# Altium project JacdacServoDual 23.PrjPCB
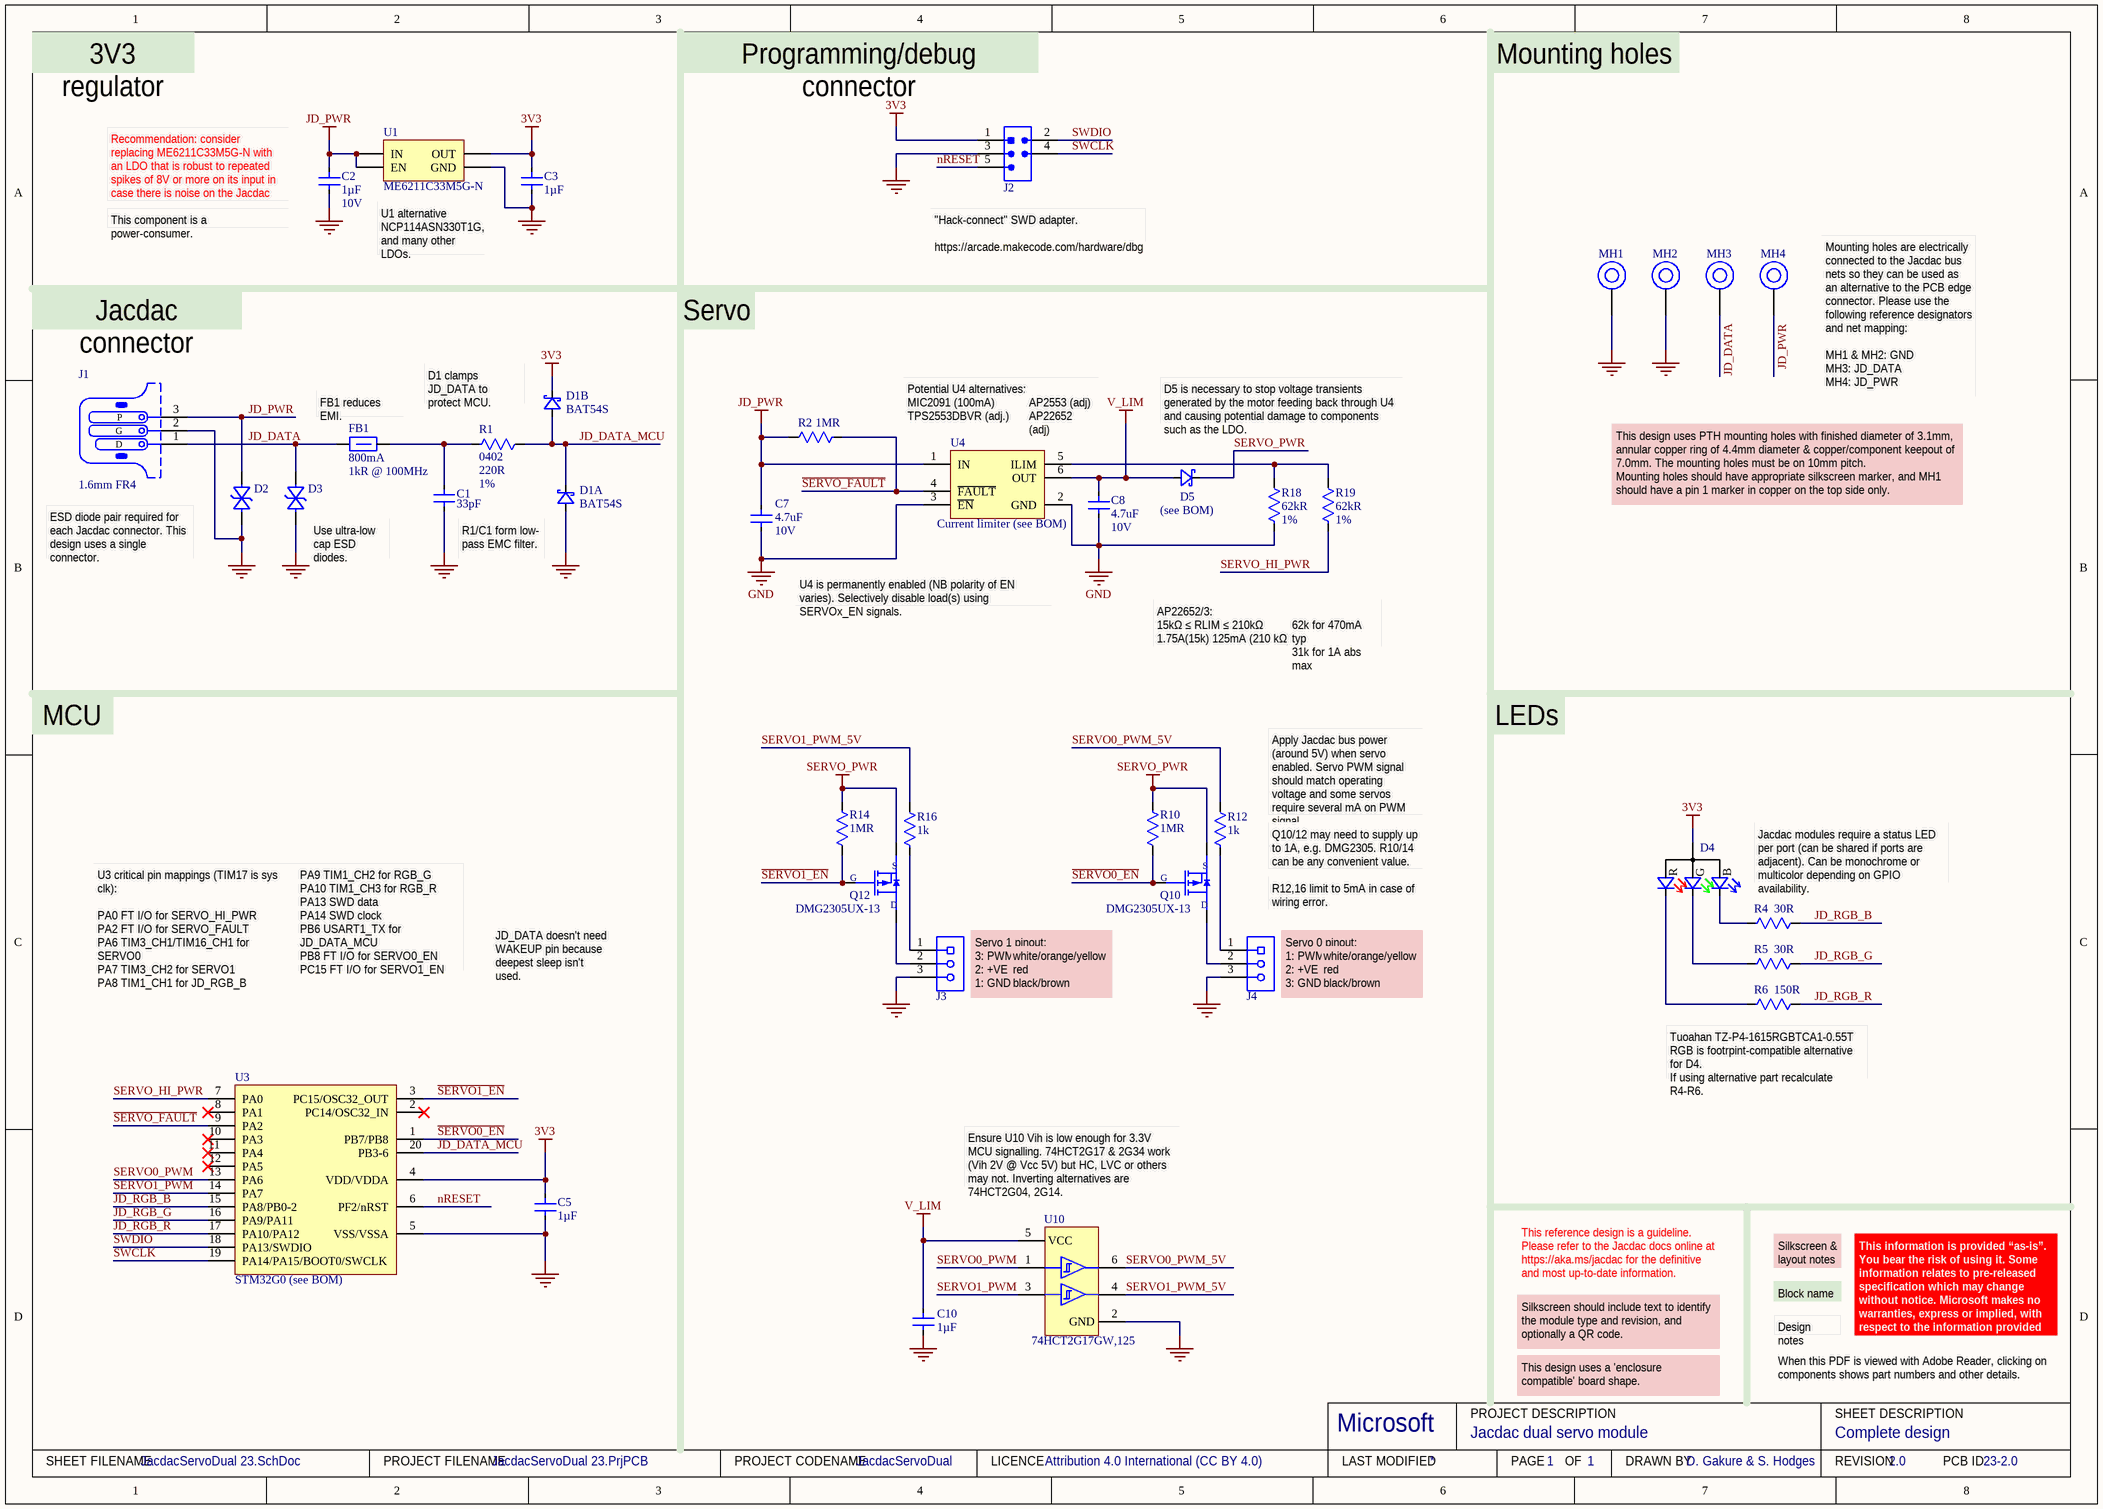
[diagram p0: JacdacServoDual 23.SchDoc]
ProjectCodeName: JacdacServoDual; ProjectCodenameDescription: Jacdac dual servo module; ProjectCodenameID: 23; ProjectDrawnBy: D. Gakure & S. Hodges; ProjectLicenceTerms: Attribution 4.0 International (CC BY 4.0); ProjectRevision: 2.0
1 sheet, 38 parts. Net scope: global (net labels, ports and power ports of the same name join across sheets).
Board file: JacdacServoDual 23.PcbDoc

## Sheet JacdacServoDual 23.SchDoc: Complete design
size A3; DrawnBy: D. Gakure & S. Hodges; DocumentNumber: 1; Revision: 2.0; SheetNumber: 1; SheetTotal: 1; VersionControl_RevNumber: 1

### Parts
C1  Capacitance: 33pF  [C0402_0.55MM - without outline]  (hidden comment: CL05C330JB5NNNC)
C2  Capacitance: 1µF  Voltage Rating: 10V  [C0402_0.55MM - without outline]  (hidden comment: CL05A105KP5NNNC)
C3  Capacitance: 1µF  [C0402_0.55MM - without outline]  (hidden comment: CL05A105KP5NNNC)
C5  Capacitance: 1µF  [C0402_0.55MM - without outline]  (hidden comment: CL05A105KP5NNNC)
C7  Capacitance: 4.7uF  Voltage Rating: 10V  [R0402 - Without outline]  (hidden comment: CL05A475MP5NRNC)
C8  Capacitance: 4.7uF  Voltage Rating: 10V  [R0402 - Without outline]  (hidden comment: CL05A475MP5NRNC)
C10  Capacitance: 1µF  [C0402_0.55MM - without outline]  (hidden comment: CL05A105KP5NNNC)
D1  BAT54S  [NXP-BAT54S-TO-236AB - without outline]  (parts A,B of 2)
D2  RCLAMP0521P-N  [TVS 0402 - L]  (value not drawn)
D3  RCLAMP0521P-N  [TVS 0402 - L]  (value not drawn)
D4  HSMF-C114  [HSMF-C114]  (value not drawn)
D5  Generic Part Number: (see BOM)  [MBR120VLSFT3G]  (hidden comment: MBR120VLSFT3G)
FB1  Current Rating: 800mA  Impedance: 1kR @ 100MHz  [TDK MPZ1608 0.8mm - without outline]  (hidden comment: TDK MPZ1608S102ATA00)
J1  PCB Type: 1.6mm FR4  [JACDAC_EDGE_CONNECTOR_NO_TRACES]  (hidden comment: 3 pin JACDAC edge connector)  (no BOM)
J2  Hack Connect Mini 1.27 mm pitch 2-row  [HACK_CONNECT_MINI_5_X_1_27]  (value not drawn)  (no BOM)
J3  TSM-103-01-L-SH-A  [TSM-103-01-L-SH-A]  (value not drawn)
J4  TSM-103-01-L-SH-A  [TSM-103-01-L-SH-A]  (value not drawn)
MH1  MH_7.0MMK_4.4MMC_3.1MMD_PTH  [MH_7.0MMK_4.4MMC_3.1MMD_PTH]  (value not drawn)  (no BOM)
MH2  MH_7.0MMK_4.4MMC_3.1MMD_PTH  [MH_7.0MMK_4.4MMC_3.1MMD_PTH]  (value not drawn)  (no BOM)
MH3  MH_7.0MMK_4.4MMC_3.1MMD_PTH  [MH_7.0MMK_4.4MMC_3.1MMD_PTH]  (value not drawn)  (no BOM)
MH4  MH_7.0MMK_4.4MMC_3.1MMD_PTH  [MH_7.0MMK_4.4MMC_3.1MMD_PTH]  (value not drawn)  (no BOM)
Q10  Manufacturer Part Number: DMG2305UX-13  [DIODES-SOT23-3]  (hidden comment: MOSFET P-CH 20V 4.2A SOT23)
Q12  Manufacturer Part Number: DMG2305UX-13  [DIODES-SOT23-3]  (hidden comment: MOSFET P-CH 20V 4.2A SOT23)
R1  Case Code (Imperial): 0402  Resistance: 220R  Tolerance: 1%  [RES0402]  (hidden comment: RC0402FR-07220RL)
R2  Resistance: 1MR  [R0402 - Without outline]  (hidden comment: RC0402FR-071ML)
R4  Resistance: 30R  [R0402 - Without outline]  (hidden comment: RC0402FR-0730RL)
R5  Resistance: 30R  [R0402 - Without outline]  (hidden comment: RC0402FR-0730RL)
R6  Resistance: 150R  [R0402 - Without outline]  (hidden comment: RC0402FR-07150RL)
R10  Resistance: 1MR  [R0402 - Without outline]  (hidden comment: RC0402FR-071ML)
R12  Resistance: 1k  [RES0402]  (hidden comment: RC0402FR-071KL)
R14  Resistance: 1MR  [R0402 - Without outline]  (hidden comment: RC0402FR-071ML)
R16  Resistance: 1k  [RES0402]  (hidden comment: RC0402FR-071KL)
R18  Resistance: 62kR  Tolerance: 1%  [R0402 - Without outline]  (hidden comment: RC0402FR-0762KL)
R19  Resistance: 62kR  Tolerance: 1%  [R0402 - Without outline]  (hidden comment: RC0402FR-0762KL)
U1  ME6211C33M5G-N  [MICRONE-SOT23-5]
U3  Generic Part Number: STM32G0 (see BOM)  [20-TSSOP]
U4  Generic Part Number: Current limiter (see BOM)  [SOT-26]  (hidden comment: AP22652W6-7)
U10  74HCT2G17GW,125  [6TSSOP_SOT457]

### Nets
3V3: C3.2 C5.2 D1.2(K) D4.1(A) J2.1(VCC) U1.5(OUT) U3.4(VDD/VDDA)
GND: C1.1 C2.1 C3.1 C5.1 C7.1 C8.1 C10.1 D1.1(A) D2.2(A) D3.2(A) J1.2(G) J2.3(GND) J3.3 J4.3 MH1.1 MH2.1 R18.1 U1.2(GND) U3.5(VSS/VSSA) U4.2(GND) U4.3(~{EN}) U10.2(GND)
JD_PWR: C2.2 C7.2 D2.1(K) J1.3(P) MH4.1 R2.1 U1.1(IN) U1.3(EN) U4.1(IN)
SERVO_PWR: D5.1(K) Q10.2(S) Q12.2(S) R10.2 R14.2
V_LIM: C8.2 C10.2 D5.2(A) U4.6(OUT) U10.5(VCC)
~{SERVO0_EN}: Q10.1(G) R10.1 U3.1(PB7/PB8)
~{SERVO1_EN}: Q12.1(G) R14.1 U3.3(PC15/OSC32_OUT)
~{SERVO_FAULT}: R2.2 U3.9(PA2) U4.4(~{FAULT})
JD_DATA: D3.1(K) FB1.1 J1.1(D) MH3.1
JD_DATA_MCU: D1.3(K) R1.1 U3.20(PB3-6)
JD_RGB_B: R4.2 U3.15(PA8/PB0-2)
JD_RGB_G: R5.2 U3.16(PA9/PA11)
JD_RGB_R: R6.2 U3.17(PA10/PA12)
nRESET: J2.5(RESET) U3.6(PF2/nRST)
SERVO0_PWM: U3.13(PA6) U10.1(1A)
SERVO0_PWM_5V: R12.1 U10.6(1Y)
SERVO1_PWM: U3.14(PA7) U10.3(2A)
SERVO1_PWM_5V: R16.1 U10.4(2Y)
SERVO_HI_PWR: R19.1 U3.7(PA0)
SWCLK: J2.4(SWCLK) U3.19(PA14/PA15/BOOT0/SWCLK)
SWDIO: J2.2(SWDIO) U3.18(PA13/SWDIO)
NetC1_2: C1.2 FB1.2 R1.2
NetD4_2: D4.2(R) R6.1
NetD4_3: D4.3(G) R5.1
NetD4_4: D4.4(B) R4.1
NetJ3_1: J3.1 R16.2
NetJ3_2: J3.2 Q12.3(D)
NetJ4_1: J4.1 R12.2
NetJ4_2: J4.2 Q10.3(D)
NetR18_2: R18.2 R19.2 U4.5(ILIM)

Not connected (* = marked no-connect by the designer): U3 2(PC14/OSC32_IN)* 8(PA1)* 10(PA3)* 11(PA4)* 12(PA5)*

### Notes on the sheet
- 3V3 regulator
- Programming/debug connector
- Mounting holes
- (near C2) Recommendation: consider replacing ME6211C33M5G-N with an LDO that is robust to repeated spikes of 8V or more on its input in case there is noise on the Jacdac bus.
- (near C2) This component is a power-consumer.
- (near J2) "Hack-connect" SWD adapter.
  https://arcade.makecode.com/hardware/dbg
- U1 alternative
  NCP114ASN330T1G, and many other LDOs.
- Jacdac connector
- Servo
- (near MH4) Mounting holes are electrically connected to the Jacdac bus nets so they can be used as an alternative to the PCB edge connector. Please use the following reference designators and net mapping:
- (near FB1) FB1 reduces EMI.
- D1 clamps JD_DATA to protect MCU.
- (near U4) Potential U4 alternatives:
  MIC2091 (100mA)
  TPS2553DBVR (adj.)
- (near U4) AP2553 (adj)
  AP22652 (adj)
- D5 is necessary to stop voltage transients generated by the motor feeding back through U4 and causing potential damage to components such as the LDO.
- MH1 & MH2: GND
  MH3: JD_DATA
  MH4: JD_PWR
- This design uses PTH mounting holes with finished diameter of 3.1mm, annular copper ring of 4.4mm diameter & copper/component keepout of 7.0mm. The mounting holes must be on 10mm pitch.
  Mounting holes should have appropriate silkscreen marker, and MH1 should have a pin 1 marker in copper on the top side only.
- ESD diode pair required for each Jacdac connector. This design uses a single connector.
- (near D3) Use ultra-low cap ESD diodes.
- R1/C1 form low-
  pass EMC filter.
- U4 is permanently enabled (NB polarity of EN varies). Selectively disable load(s) using SERVOx_EN signals.
- AP22652/3:
  15kΩ ≤ RLIM ≤ 210kΩ
  1.75A(15k) 125mA (210 kΩ)
- 62k for 470mA typ
  31k for 1A abs max
- MCU
- LEDs
- Apply Jacdac bus power (around 5V) when servo enabled. Servo PWM signal should match operating voltage and some servos require several mA on PWM signal.
- R12,16 limit to 5mA in case of wiring error.
- Q10/12 may need to supply up to 1A, e.g. DMG2305. R10/14 can be any convenient value.
- Jacdac modules require a status LED per port (can be shared if ports are adjacent). Can be monochrome or multicolor depending on GPIO availability.
- U3 critical pin mappings (TIM17 is sys clk):
  PA0 FT I/O for SERVO_HI_PWR
  PA2 FT I/O for SERVO_FAULT
  PA6 TIM3_CH1/TIM16_CH1 for SERVO0
  PA7 TIM3_CH2 for SERVO1
  PA8 TIM1_CH1 for JD_RGB_B
- PA9 TIM1_CH2 for RGB_G
  PA10 TIM1_CH3 for RGB_R
  PA13 SWD data
  PA14 SWD clock
  PB6 USART1_TX for JD_DATA_MCU
  PB8 FT I/O for SERVO0_EN
  PC15 FT I/O for SERVO1_EN
- JD_DATA doesn't need WAKEUP pin because deepest sleep isn't used.
- (near J3) Servo 1 pinout:
  3: PWM
  2: +VE
  1: GND
- white/orange/yellow
  red
  black/brown
- (near J4) Servo 0 pinout:
  1: PWM
  2: +VE
  3: GND
- (near R6) Tuoahan TZ-P4-1615RGBTCA1-0.55T RGB is footrpint-compatible alternative for D4.
  If using alternative part recalculate R4-R6.
- Ensure U10 Vih is low enough for 3.3V MCU signalling. 74HCT2G17 & 2G34 work (Vih 2V @ Vcc 5V) but HC, LVC or others may not. Inverting alternatives are 74HCT2G04, 2G14.
- Silkscreen & layout notes
- This reference design is a guideline. Please refer to the Jacdac docs online at https://aka.ms/jacdac for the definitive and most up-to-date information.
- Block name
- This design uses a 'enclosure compatible' board shape.
- Silkscreen should include text to identify the module type and revision, and optionally a QR code.
- Design notes
- When this PDF is viewed with Adobe Reader, clicking on components shows part numbers and other details.
- This information is provided “as-is”. You bear the risk of using it. Some information relates to pre-released specification which may change without notice. Microsoft makes no warranties, express or implied, with respect to the information provided here.
- Microsoft
- PROJECT DESCRIPTION
- SHEET DESCRIPTION
- SHEET FILENAME
- PROJECT FILENAME
- PROJECT CODENAME
- LICENCE
- LAST MODIFIED
- PAGE
- OF
- DRAWN BY
- REVISION
- PCB ID

### Library data of the parts
C1 = CL05C330JB5NNNC: CAP CER 33PF 50V C0G/NP0 0402; Manufacturer: Samsung; Material: Ceramic; Tolerance: 5%; Dielectric: C0G; Temperature Coefficient: 300ppm/°C; Supplier 1: Digi-Key; Manufacturer Part Number: CL05C330JB5NNNC; RoHS: Yes; Category: Ceramic Capacitors; Stock 1: 5436088; Pricing 1: 1=0.10000, 10=0.02300, 50=0.01260, 100=0.01040, 500=0.00740, 1000=0.00582, 2500=0.00529, 5000=0.00487 (USD); Mount: Surface Mount; Case Code (Metric): 1005; Case Code (Imperial): 0402; Contact Plating: Tin; Min Operating Temperature: -55°C; Max Operating Temperature: 125°C; Package Quantity: 1; Packaging: Tape and Reel; Voltage: 50V; Voltage Rating (DC): 50V; Series: CL; Construction: Flat; Length: 1mm; Width: 0.02inch; Height: 0.5mm; Thickness: 0.022inch; Depth: 0.5mm; Radiation Hardening: No; Lead Free: Lead Free; RoHS Compliant: Yes; ComponentLink1URL: https://datasheet.ciiva.com/15195/getdatasheetpartid-355282-15195687.pdf; ComponentLink1Description: Online datasheet; Supplier 2: Newark; Stock 2: 45340; Pricing 2: 1=0.12500, 25=0.02900, 100=0.01300, 250=0.01100, 500=0.00900, 1000=0.00600 (USD); Supplier 3: Mouser; Stock 3: 8877; Pricing 3: 1=0.10000, 10=0.01400, 50=0.01400, 100=0.01100, 1000=0.00600, 10000=0.00400 (USD); Supplier 4: Farnell; Stock 4: 10934; Pricing 4: 150=0.01120, 500=0.00860, 2500=0.00640, 5000=0.00550 (GBP); Supplier Part Number 4: 3013373RL; Supplier Part Number 3: 187-CL05C330JB5NNNC; Supplier Part Number 2: 82AC9259; Supplier Part Number 1: 1276-1272-1-ND; Voltage Rating: 50V; Case/Package: 0402
C2 C3 C5 C10 = CL05A105KP5NNNC: CAP CER 1UF 10V X5R 0402; Manufacturer: Samsung; Material: Ceramic; Tolerance: 10%; Supplier 1: Digi-Key; Manufacturer Part Number: CL05A105KP5NNNC; RoHS: Yes; Category: Capacitors; Stock 1: 5705569; Pricing 1: 1=0.10000, 10=0.03900, 50=0.02100, 100=0.01720, 500=0.01228, 1000=0.00965, 2500=0.00877, 5000=0.00807 (USD); Mount: Surface Mount; Case/Package: 0402; Case Code (Metric): 1005; Contact Plating: Tin; Min Operating Temperature: -55°C; Max Operating Temperature: 85°C; Dielectric: X5R; Package Quantity: 1; Packaging: Tape and Reel; Length: 1mm; Height: 0.5mm; Width: 0.02inch; Thickness: 0.022inch; Depth: 0.5mm; Radiation Hardening: No; ComponentLink1URL: https://datasheet.ciiva.com/15195/getdatasheetpartid-358390-15195630.pdf; ComponentLink1Description: Online datasheet; Supplier 2: Mouser; Stock 2: 928941; Pricing 2: 1=0.10000, 10=0.04200, 100=0.01800, 500=0.01300, 1000=0.01000, 2500=0.00900 (USD); Supplier 3: Farnell; Stock 3: 53670; Pricing 3: 10=0.02450, 100=0.02000, 500=0.01310, 2500=0.00920, 5000=0.00810, 10000=0.00640, 50000=0.00490 (GBP); Supplier Part Number 3: 3013329; Supplier Part Number 2: 187-CL05A105KP5NNNC; Supplier Part Number 1: 1276-1076-1-ND; Created: DG; Checked: ?; Case Code (Imperial): 0402
  C3 C5 C10: Voltage Rating: 10V
C7 C8 = CL05A475MP5NRNC: CAP CER 4.7UF 10V X5R 0402; Manufacturer: Samsung; Tolerance: 20%; Supplier 1: Digi-Key; Manufacturer Part Number: CL05A475MP5NRNC; RoHS: Yes; Category: Ceramic Capacitors; Stock 1: 840000; Pricing 1: 10000=0.01405, 20000=0.01338 (USD); Mount: Surface Mount; Case/Package: 0402; Case Code (Metric): 1005; Min Operating Temperature: -55°C; Max Operating Temperature: 85°C; Package Quantity: 10000; Packaging: Tape and Reel; Dielectric: X5R; Series: CL; Length: 0.039inch; Width: 0.02inch; Thickness: 0.022inch; Lead Free: Lead Free; RoHS Compliant: Yes; ComponentLink1URL: https://datasheet.ciiva.com/25786/cl05a475mp5nrnc-25786963.pdf; ComponentLink1Description: Online datasheet; Supplier 2: Future Electronics; Stock 2: 2004; Pricing 2: 1=0.23500, 500=0.03970, 1500=0.02900, 2500=0.02500, 5000=0.02050 (USD); Created By: D. Gakure; Checked By: ?; Supplier Part Number 2: 2103694; Supplier Part Number 1: 1276-1482-2-ND; Case Code (Imperial): 0402
D1 = BAT54S: DIODE ARRAY SCHOTTKY 30V SOT23; Manufacturer: Nexperia; Manufacturer Part Number: BAT54S,235; Supplier 1: Digi-Key; RoHS: No; Category: Rectifier Diodes; Stock 1: 14011; Pricing 1: 1=0.13000, 10=0.11900, 100=0.05610, 500=0.03326, 1000=0.02185, 5000=0.02138 (USD); ComponentLink1URL: https://assets.nexperia.com/documents/data-sheet/BAT54_SER.pdf; ComponentLink1Description: NXP datasheet online; Supplier 2: Mouser; Supplier 3: RSComponents; Supplier Part Number 2: 771-BAT54S235; Supplier Part Number 3: 1707990; Supplier Part Number 1: 1727-1868-1-ND; Generic Part Number: BAT54S
D2 D3 = RCLAMP0521P-N: Bidirectional 5V (Max) 6V 16V 3.5A (8/20us) 0402 TVS RoHS; Manufacturer: Born Semiconductor; Package: 0402; Created By: D Gakure; Checked By: ?; Supplier1: LCSC; Supplier1 Part Number: C316043; ComponentLink1Description: Online datasheet; ComponentLink1URL: https://datasheet.lcsc.com/szlcsc/Bourne-Semicon-Shenzhen-RCLAMP0521P-N_C316043.pdf; Manufacturer Part Number: RCLAMP0521P-N
D4 = HSMF-C114: Red, Green, Blue (RGB) 626nm Red, 525nm Green, 470nm Blue LED Indication - Discrete 1.9V Red, 3.4V Green, 3.4V Blue 0606 (1616 Metric); Manufacturer: Broadcom Avago; Color: Blue,Green,Red; Lens Color: White; Viewing Angle: 145°; Luminous Intensity: 70mcd; Lens Style: Diffused,Rectangular; Forward Current: 20mA; Lens Transparency: Diffused; Number of Elements: 3; Reverse Voltage: 5V; Power Rating: 78mW; Supplier 1: Digi-Key; Manufacturer Part Number: HSMF-C114; RoHS: Yes; Category: Optoelectronics; Stock 1: 20555; Pricing 1: 1=1.78000, 10=1.12500, 100=0.83250, 500=0.76500, 1000=0.63000, 2000=0.59850 (USD); Mount: Surface Mount; Case/Package: 0606; Number of Pins: 4; Case Code (Metric): 1616; Case Code (Imperial): 0606; Min Operating Temperature: -40°C; Max Operating Temperature: 85°C; Forward Voltage: 3.4V; Packaging: Tape and Reel; Wavelength: 470nm; Package Quantity: 4000; Dominant Wavelength: 470nm; Test Current: 20mA; Number of LEDs: 3; Length: 1.6mm; Width: 1.5mm; Height: 0.35mm; Depth: 1.6mm; Radiation Hardening: No; REACH SVHC: No SVHC; Lead Free: Lead Free; Supplier 2: Farnell; Stock 2: 8134; Pricing 2: 1=1.56000, 10=0.97100, 25=0.87800, 50=0.78500, 100=0.69200, 500=0.60500 (GBP); Supplier 3: Mouser; Stock 3: 14991; Pricing 3: 1=1.69000, 10=1.13000, 50=1.13000, 100=0.85600, 1000=0.74800, 10000=0.74800 (USD); Supplier Part Number 1: 516-1795-1-ND; Supplier Part Number 3: 630-HSMF-C114; Supplier Part Number 2: 1058362; ComponentLink1Description: Online datasheet; ComponentLink1URL: https://docs.broadcom.com/docs/AV02-2451EN; Created By: D. Gakure; Checked By: ?; Supplier Part Number 10: ?
D5 = MBR120VLSFT3G: DIODE SCHOTTKY 20V 1A SOD123FL; Manufacturer: ON Semiconductor; Max Surge Current: 45A; Forward Voltage: 340mV; Peak Reverse Current: 600uA; Element Configuration: Single; Polarity: Standard; Supplier 1: Digi-Key; RoHS: Yes; Category: Schottky Diodes; Stock 1: 32481; Pricing 1: 1=0.39000, 10=0.28600, 100=0.19920, 500=0.12616, 1000=0.10292, 2000=0.09960, 5000=0.09628 (USD); Number of Pins: 2; Min Operating Temperature: -65°C; Max Operating Temperature: 125°C; Package Quantity: 10000; Forward Current: 1A; Packaging: Tape and Reel; Max Reverse Leakage Current: 600uA; Average Rectified Current: 1A; Peak Non-Repetitive Surge Current: 45A; Max Repetitive Reverse Voltage (Vrrm): 20V; Max Forward Surge Current (Ifsm): 45A; Voltage Rating (DC): 20V; Current Rating: 1A; Output Current: 1A; Max Reverse Voltage (DC): 20V; Radiation Hardening: No; REACH SVHC: No SVHC; Lead Free: Lead Free; Halogen Free: Halogen Free; ComponentLink4URL: https://datasheet.ciiva.com/6380/mbr120vlsft1-d-6380910.pdf; ComponentLink4Description: On Semi datasheet online; Supplier 2: Mouser; Supplier 3: RSComponents; Supplier Part Number 3: 1867479; Supplier Part Number 2: 863-MBR120VLSFT3G; Supplier Part Number 1: MBR120VLSFT3GOSCT-ND; Manufacturer Part Number: MBR120VLSFT3G
FB1 = TDK MPZ1608S102ATA00: 0603 1k@100MHz 0.8A chip; Core Material: Ferrite; Tolerance: 25%; DC Resistance (DCR): 300mR; Supplier 1: Digi-Key; Stock 1: 113542; Pricing 1: 1=0.1, 10=0.079, 25=0.0716, 50=0.0644, 100=0.0472, 250=0.03432, 500=0.03146, 1000=0.02717 (USD); Mount: Surface Mount; Case/Package: 0603; Case Code (Metric): 1608; Case Code (Imperial): 0603; Package Quantity: 4000; Packaging: Tape and Reel; Max DC Current: 800mA; Length: 0.063inch; Height: 0.037inch; Width: 0.031inch; ComponentLink2URL: https://www.mouser.co.uk/datasheet/2/400/eads_commercial_power_mpz1608_en-923650.pdf; ComponentLink2Description: datasheet online; Supplier 2: Mouser; ComponentLink3Description: datasheet; ComponentLink3URL: Y:\System\Altium\Libraries 2014\TDK\Datasheets\eads_commercial_power_mpz1608_en-923650.pdf; Supplier Part Number 1: 445-8694-1-ND; Supplier Part Number 2: 810-MPZ1608S102ATA00; Manufacturer: TDK; Manufacturer Part Number: MPZ1608S102ATA00
J1 = Jacdac edge connector: 3 pin Jacdac edge connector 1.27mm pitch; Manufacturer Part Number: JACDAC_EDGE_CONNECTOR; Checked By: ?; Created By: D. Gakure; ComponentLink1Description: Yuliang JACDAC cable connector drawing online; ComponentLink1URL: https://github.com/microsoft/jacdac-mdk/blob/main/connector/JACDAC-Connector-by-Yuliang-2020-11-28.pdf; ComponentLink2Description: JACDAC PCB edge connector spec onlin; ComponentLink2URL: https://github.com/microsoft/jacdac-mdk/blob/main/connector/JACDAC_PCB_Edge_Connector_Drawing_JD-PEC-01_rev_01.pdf
J2 = HACK_CONNECT_MINI
J3 J4 = TSM-103-01-L-SH-A-whitesch: SAMTEC         TSM-103-01-L-SH-A             Board-To-Board Connector, TSM Series, 3 Contacts, Header, 2.54 mm, Surface Mount, 1 Rows; Number of Contacts: 3; Gender: Male; Pitch: 2.54mm; ComponentLink2Description: part of technical drawing online; ComponentLink2URL: https://datasheet.ciiva.com/25616/0900766b8115801b-25616876.pdf; ComponentLink3Description: part of technical drawing; ComponentLink3URL: Y:\System\Altium\Libraries 2014\Samtec\Datasheets\TSM drawing.pdf; ComponentLink4Description: samtec datasheet; ComponentLink4URL: Y:\System\Altium\Libraries 2014\Samtec\Datasheets\tsm.pdf; ComponentLink5Description: samtec datasheet online; ComponentLink5URL: https://uk.rs-online.com/webdocs/1157/0900766b81157e6c.pdf?src-supplier=RSComponents; Manufacturer: Samtec; Manufacturer Part Number: TSM-103-01-L-SH-A; Contact Plating: Gold; Number of Rows: 1; Packaging: Bulk; Termination: Solder; Radiation Hardening: No; Lead Free: Lead Free; Supplier 1: Digi-Key; Supplier 2: RSComponents; Supplier 3: Mouser; Supplier Part Number 1: SAM12221-ND; Supplier Part Number 3: 200-TSM10301LSHA; Supplier Part Number 2: 2001543
MH1-MH4 = MH_7.0MMK_4.4MMC_3.1MMD_PTH: Mounting Hole 7.0mm keepout, 4.4mm annualar ring and 3.1mm Drill PTH
Q10 Q12 = DMG2305UX-whitesch: Manufacturer: Diodes; Rise Time: 13.7ns; Rds On Max: 52mR; Input Capacitance: 808pF; Max Power Dissipation: 1.4W; Turn-On Delay Time: 10.8ns; Turn-Off Delay Time: 79.3ns; Fall Time: 34.7ns; Threshold Voltage: -900mV; Element Configuration: Single; Gate to Source Voltage (Vgs): 8V; Number of Channels: 1; Drain to Source Breakdown Voltage: -20V; On-State Resistance: 65MR; Supplier 1: Digi-Key; Stock 1: 131638; Pricing 1: 1=0.44, 10=0.398, 100=0.2228, 500=0.1194, 1000=0.0812 (USD); Mount: Surface Mount; Case/Package: TO-236-3; Number of Pins: 3; Weight: 0.000282oz; Min Operating Temperature: -55°C; Max Operating Temperature: 150°C; Package Quantity: 1; Packaging: Tape and Reel; Continuous Drain Current (ID): 4.2A; Drain to Source Voltage (Vdss): 20V; Drain to Source Resistance: 52mR; Length: 3mm; Height: 1.1mm; Width: 1.4mm; Radiation Hardening: No; REACH SVHC: No SVHC; Lead Free: Lead Free; ComponentLink2URL: https://datasheet.ciiva.com/18566/dmg2305ux-18566951.pdf; ComponentLink2Description: online datasheet; Supplier Part Number 1: DMG2305UX-13DICT-ND; ComponentLink3Description: datasheet; ComponentLink3URL: Y:\System\Altium\Libraries 2014\Diodes Inc\Datasheets\dmg2305ux-30023840.pdf; Supplier 2: Farnell; Supplier 3: Mouser; Supplier 4: RSComponents; Supplier Part Number 2: 2543533; Supplier Part Number 3: 621-DMG2305UX-7; Supplier Part Number 4: 8270452
R1 = RC0402FR-07220RL: RES SMD 220 OHM 1% 1/16W 0402; Manufacturer: Yageo; Power Rating: 62.5mW; Voltage Rating: 50V; Temperature Coefficient: 100ppm/°C; Max Power Dissipation: 63mW; Supplier 1: Digi-Key; Manufacturer Part Number: RC0402FR-07220RL; RoHS: Yes; Category: Resistors; Stock 1: 1286042; Pricing 1: 1=0.10000, 10=0.01400, 100=0.00580, 1000=0.00262, 2500=0.00228, 5000=0.00188 (USD); Case/Package: 0402; Number of Pins: 2; Case Code (Metric): 1005; Min Operating Temperature: -55°C; Max Operating Temperature: 155°C; Packaging: Tape and Reel; Voltage Rating (DC): 50V; Package Quantity: 1; Termination: SMD/SMT; Resistor Type: Thick Film; Number of Terminations: 2; Features: Moisture Resistant; Length: 1mm; Height: 0.016inch; Width: 0.02inch; Depth: 0.5mm; REACH SVHC: No SVHC; Military Standard: Not; Lead Free: Lead Free; ComponentLink1URL: https://datasheet.ciiva.com/11819/0900766b80c66297-11819466.pdf; ComponentLink1Description: Online datasheet; Supplier 2: Mouser; Stock 2: 324625; Pricing 2: 1=0.10000, 10=0.01200, 100=0.00400, 1000=0.00400, 2500=0.00400, 10000=0.00300 (USD); Supplier 3: Farnell; Stock 3: 18234; Pricing 3: 1=0.08130, 25=0.01210, 100=0.01120, 250=0.01030, 500=0.00900 (GBP); Supplier Part Number 3: 2147864; Supplier Part Number 2: 603-RC0402FR-07220RL; Supplier Part Number 1: 311-220LRCT-ND; Created: D.G; Checked: ?
R2 R10 R14 = RC0402FR-071ML: RES SMD 1M OHM 1% 1/16W 0402; Manufacturer: Yageo; Power Rating: 63mW; Voltage Rating: 50V; Temperature Coefficient: 100ppm/°C; Supplier 1: Digi-Key; Manufacturer Part Number: RC0402FR-071ML; RoHS: Yes; Category: Chip SMD Resistors; Stock 1: 7856490; Pricing 1: 1=0.10000, 10=0.01600, 100=0.00640, 1000=0.00286, 2500=0.00248, 5000=0.00205 (USD); Case/Package: 0402; Case Code (Metric): 1005; Size Code: 0402; Min Operating Temperature: -55°C; Max Operating Temperature: 155°C; Resistor Type: Thick Film; Packaging: Tape and Reel; Termination: SMD/SMT; Features: Moisture Resistant; Series: RC; Max Power Dissipation: 63mW; Number of Terminations: 2; Resistance Tolerance: 1%; Construction: Rectangular; Technology: THICK FILM; Length: 1mm; Height: 0.32mm; Depth: 0.5mm; RoHS Compliant: Yes; REACH SVHC: Unknown; Military Standard: Not; Lead Free: Lead Free; ComponentLink1URL: https://datasheet.ciiva.com/11808/0900766b80c66297-11808125.pdf; ComponentLink1Description: Online datasheet; Supplier 2: Mouser; Stock 2: 1194490; Pricing 2: 1=0.10000, 10=0.01200, 50=0.01200, 100=0.00400, 1000=0.00400, 10000=0.00300 (USD); Supplier 3: Farnell; Stock 3: 1530000; Pricing 3: 10000=0.00290, 50000=0.00200 (GBP); Created By: D. Gakure; Supplier Part Number 2: 603-RC0402FR-071ML; Supplier Part Number 1: 311-1.00MLRCT-ND; Checked By: ?; Supplier Part Number 3: 2421892; Tolerance: 1%; Case Code (Imperial): 0402
R4 R5 = RC0402FR-0730RL: RES SMD 30 OHM 1% 1/16W 0402; Manufacturer: Yageo; Temperature Coefficient: 100ppm/°C; Power Rating: 63mW; Voltage Rating: 50V; Supplier 1: Digi-Key; Manufacturer Part Number: RC0402FR-0730RL; RoHS: Yes; Category: Chip SMD Resistors; Stock 1: 2973; Pricing 1: 1=0.10000, 10=0.01400, 100=0.00580, 1000=0.00260, 2500=0.00226, 5000=0.00186 (USD); Case/Package: 0402; Contact Plating: Tin,Matte; Case Code (Metric): 1005; Size Code: 0402; Min Operating Temperature: -55°C; Max Operating Temperature: 155°C; Resistor Type: Thick Film; Packaging: Tape and Reel; Termination: SMD/SMT; Voltage Rating (DC): 50V; Features: Moisture Resistant; Series: RC; Max Power Dissipation: 63mW; Number of Terminations: 2; Construction: Rectangular; Resistance Tolerance: 1%; Length: 1mm; Width: 0.5mm; Height: 0.35mm; Depth: 0.5mm; REACH SVHC: Unknown; Military Standard: Not; Lead Free: Lead Free; RoHS Compliant: Yes; ComponentLink1URL: https://datasheet.ciiva.com/7849/1018594-7849958.pdf; ComponentLink1Description: Online datasheet; Supplier 2: Mouser; Stock 2: 41804; Pricing 2: 1=0.10000, 10=0.01200, 50=0.01200, 100=0.00400, 1000=0.00400, 10000=0.00300 (USD); Supplier 3: Farnell; Stock 3: 4422; Pricing 3: 10=0.01210, 100=0.00420, 500=0.00370, 2500=0.00280, 5000=0.00250, 10000=0.00230, 50000=0.00150 (GBP); Supplier Part Number 3: 1458775; Supplier Part Number 2: 603-RC0402FR-0730RL; Supplier Part Number 1: 311-30LRCT-ND; Created By: D. Gakure; Checked By: ?; Tolerance: 1%; Case Code (Imperial): 0402
R6 = RC0402FR-07150RL: RES SMD 150 OHM 1% 1/16W 0402; Manufacturer: Yageo; Power Rating: 62.5mW; Voltage Rating: 50V; Temperature Coefficient: 100ppm/°C; Max Power Dissipation: 63mW; Supplier 1: Digi-Key; Manufacturer Part Number: RC0402FR-07150RL; RoHS: Yes; Category: Chip SMD Resistors; Stock 1: 5214533; Pricing 1: 1=0.10000, 10=0.01400, 100=0.00580, 1000=0.00260, 2500=0.00226, 5000=0.00186 (USD); Case/Package: 0402; Case Code (Metric): 1005; Min Operating Temperature: -55°C; Max Operating Temperature: 155°C; Packaging: Tape and Reel; Package Quantity: 1; Resistor Type: Thick Film; Number of Terminations: 2; Termination: SMD/SMT; Working Voltage: 50V; Features: Moisture Resistant; Series: RC; Resistance Tolerance: 1%; Construction: Rectangular; Technology: THICK FILM; Length: 1mm; Width: 0.02inch; Height: 0.016inch; Depth: 0.5mm; REACH SVHC: No SVHC; Military Standard: Not; Lead Free: Lead Free; RoHS Compliant: Yes; ComponentLink1URL: https://datasheet.ciiva.com/11808/0900766b80c66297-11808422.pdf; ComponentLink1Description: ine datasheet; Supplier 2: Mouser; Stock 2: 582717; Pricing 2: 1=0.10000, 10=0.01200, 50=0.01200, 100=0.00400, 1000=0.00400, 10000=0.00300 (USD); Supplier 3: Farnell; Stock 3: 880000; Pricing 3: 10000=0.00270, 50000=0.00200 (GBP); Created by: D. Gakure; Checked By: ?; Supplier Part Number 3: 2421893; Supplier Part Number 2: 603-RC0402FR-07150RL; Supplier Part Number 1: 311-150LRCT-ND; Tolerance: 1%; Case Code (Imperial): 0402
R12 R16 = RC0402FR-071KL: RES SMD 1K OHM 1% 1/16W 0402; Manufacturer: Yageo; Temperature Coefficient: 100ppm/°C; Voltage Rating (DC): 50V; Power Rating: 62.5mW; Supplier 1: Digi-Key; Manufacturer Part Number: RC0402FR-071KL; RoHS: Yes; Category: Resistors; Stock 1: 37591306; Pricing 1: 1=0.10000, 10=0.01400, 100=0.00580, 1000=0.00262, 2500=0.00228, 5000=0.00188 (USD); Case/Package: 0402; Number of Pins: 2; Case Code (Imperial): 0402; Case Code (Metric): 1005; Min Operating Temperature: -55°C; Max Operating Temperature: 155°C; Resistor Type: Thick Film; Tolerance: 1%; Packaging: Tape and Reel; Voltage Rating: 50V; Termination: SMD/SMT; Length: 1mm; Height: 0.32mm; Width: 0.5mm; Depth: 0.5mm; REACH SVHC: Unknown; Lead Free: Lead Free; Military Standard: Not; ComponentLink2URL: https://datasheet.ciiva.com/12666/pyu-rc0402-51-rohs-l-6-r-12666741.pdf; ComponentLink2Description: Online datasheet; Supplier 2: Mouser; Stock 2: 11912978; Pricing 2: 1=0.10000, 10=0.01200, 100=0.00400, 1000=0.00400, 2500=0.00400, 10000=0.00300 (USD); Supplier 3: Farnell; Stock 3: 29900; Pricing 3: 1=0.08130, 25=0.01210, 100=0.01120, 250=0.01030, 500=0.00900 (GBP); Supplier Part Number 3: 2132441; Supplier Part Number 2: 603-RC0402FR-071KL; Supplier Part Number 1: 311-1.00KLRDKR-ND; Created: D.G; Checked: ?
R18 R19 = RC0402FR-0762KL: RES SMD 62K OHM 1% 1/16W 0402; Manufacturer 1: Yageo; Temperature Coefficient: 100ppm/°C; Power Rating: 63mW; Voltage Rating: 50V; Supplier 1: Digi-Key; RoHS: Yes; Category: Chip SMD Resistors; Stock 1: 306735; Pricing 1: 1=0.10000, 10=0.01600, 100=0.00660, 1000=0.00299, 2500=0.00259, 5000=0.00214 (USD); Case/Package: 0402; Case Code (Imperial): 0402; Case Code (Metric): 1005; Min Operating Temperature: -55°C; Max Operating Temperature: 155°C; Resistor Type: Thick Film; Packaging: Tape and Reel; Termination: SMD/SMT; Voltage Rating (DC): 50V; Features: Moisture Resistant; Series: RC; Max Power Dissipation: 63mW; Number of Terminations: 2; Construction: Rectangular; Length: 1mm; Depth: 0.5mm; Military Standard: Not; Lead Free: Lead Free; RoHS Compliant: Yes; ComponentLink1URL: https://datasheet.ciiva.com/17068/pyu-rc0402-51-rohs-l-6-r-17068614.pdf; ComponentLink1Description: Online datasheet; Supplier 2: Farnell; Supplier 3: RSComponents; Supplier Part Number 3: 1987847; Supplier Part Number 2: 1458817; Supplier Part Number 1: 311-62.0KLRCT-ND; Manufacturer Part Number 1: RC0402FR-0762KL; Working Voltage: 50V; Resistance Tolerance: 1%; Technology: THICK FILM; Height: 0.32mm; REACH SVHC: Unknown
U1 = ME6211C33M5G-N: 6V 260mV @ 200mA(typ) - - Fixed 3.3V SOT-23-5 Linear Voltage Regulators (LDO) ROHS; manufacturer: MICRONE(Nanjing Micro One Elec); Output Current: 500mA; Output Configuration: Positive; Number of Regulators: 1; Max Input Voltage: 6; Dropout Voltage: 200mV; Supplier Part Number: C82942; Category: Voltage Regulators - Linear; Stock 1: 32529; Pricing 1: 1=0.33000, 10=0.24900, 25=0.21760, 100=0.12440, 250=0.11664, 500=0.09330, 1000=0.07153 (USD); Mount: Surface Mount; Case/Package: SOT-23-5; Supplier 1: LCSC; Output Type: Fixed; Min Output Voltage: 3.3V; ComponentLink3URL: https://datasheet.lcsc.com/lcsc/1811131510_MICRONE-Nanjing-Micro-One-Elec-ME6211C33M5G-N_C82942.pdf; ComponentLink3Description: On Semi datasheet online; Created: DG; Checked: ?; Manufacturer Part Number: ME6211C33M5G-N
U3 = STM32G031F6P6: MCU 32-Bit STM32G031 ARM Cortex-M0+ RISC 32KB Flash 1.7V to 3.6V 20-Pin TSSOP Tube; Manufacturer: STMicroelectronics; Supplier 1: Digi-Key; RoHS: Yes; Category: Microcontrollers; Stock 1: 166; Pricing 1: 1=2.39000, 10=2.14400, 25=2.02240, 100=1.72330, 250=1.61808, 500=1.41582, 1000=1.17985 (USD); Supplier 2: Farnell; Pricing 2: 1480=0.78200 (GBP); Supplier 3: RSComponents; Created by: D. Gakure; Checked by: ?; Supplier Part Number 2: 3246918; Supplier Part Number 1: 497-19774-ND; Supplier Part Number 3: 1939834; ComponentLink1Description: Online datasheet; ComponentLink1URL: https://www.st.com/resource/en/datasheet/stm32g031c6.pdf; Manufacturer Part Number: STM32G031F6P6; ComponentLink2Description: Online reference manual; ComponentLink2URL: https://www.st.com/resource/en/reference_manual/rm0454-stm32g0x0-advanced-armbased-32bit-mcus-stmicroelectronics.pdf
U4 = AP22652W6-7: USB Power High Side Switch Single 3V to 5.5V 2.1A 6-Pin SOT-26 T/R; Manufacturer 1: Diodes; Supplier 1: Digi-Key; RoHS: Yes; Category: USB Interface ICs; Stock 1: 93090; Pricing 1: 1=0.46000, 10=0.39600, 25=0.37000, 100=0.29590, 250=0.27476, 500=0.23250, 1000=0.17966 (USD); Supplier 2: Mouser; Supplier Part Number 1: 31-AP22652W6-7CT-ND; Supplier Part Number 2: 621-AP22652W6-7; ComponentLink1Description: Online datasheet; ComponentLink1URL: https://www.diodes.com/assets/Datasheets/AP22653Q.pdf; Manufacturer Part Number 1: AP22652W6-7
U10 = 74HCT2G17GW,125: 74HCT2G17 Series 5.5 V 4 mA Dual Non-Inverting Schmitt Trigger - TSSOP-6; Manufacturer 1: Nexperia; Supplier 1: Digi-Key; RoHS: Yes; Category: Logic Gates; Pricing 1: 1=0.46000, 10=0.34900, 25=0.31440, 100=0.21710, 250=0.18284, 500=0.14854, 1000=0.11427 (USD); ComponentLink1URL: https://assets.nexperia.com/documents/data-sheet/74LVC2G17.pdf; ComponentLink1Description: Online datasheet; Supplier 2: Farnell; Supplier 3: Mouser; Supplier Part Number 3: 771-HCT2G17GW125; Supplier Part Number 1: 1727-6931-1-ND; Supplier Part Number 2: 2777768; RoHS Compliant: Yes; ComponentLink2URL: https://assets.nexperia.com/documents/data-sheet/74HC_HCT2G17.pdf?src-supplier=Digi-Key; ComponentLink2Description: https://assets.nexperia.com/documents/data-sheet/74HC_HCT2G17.pdf?src-supplier=Digi-Key; Manufacturer Part Number 1: 74HCT2G17GW,125